# EAGLE design Fantail Go (EAGLE 9.2.2)

## Sheet 1 of 2
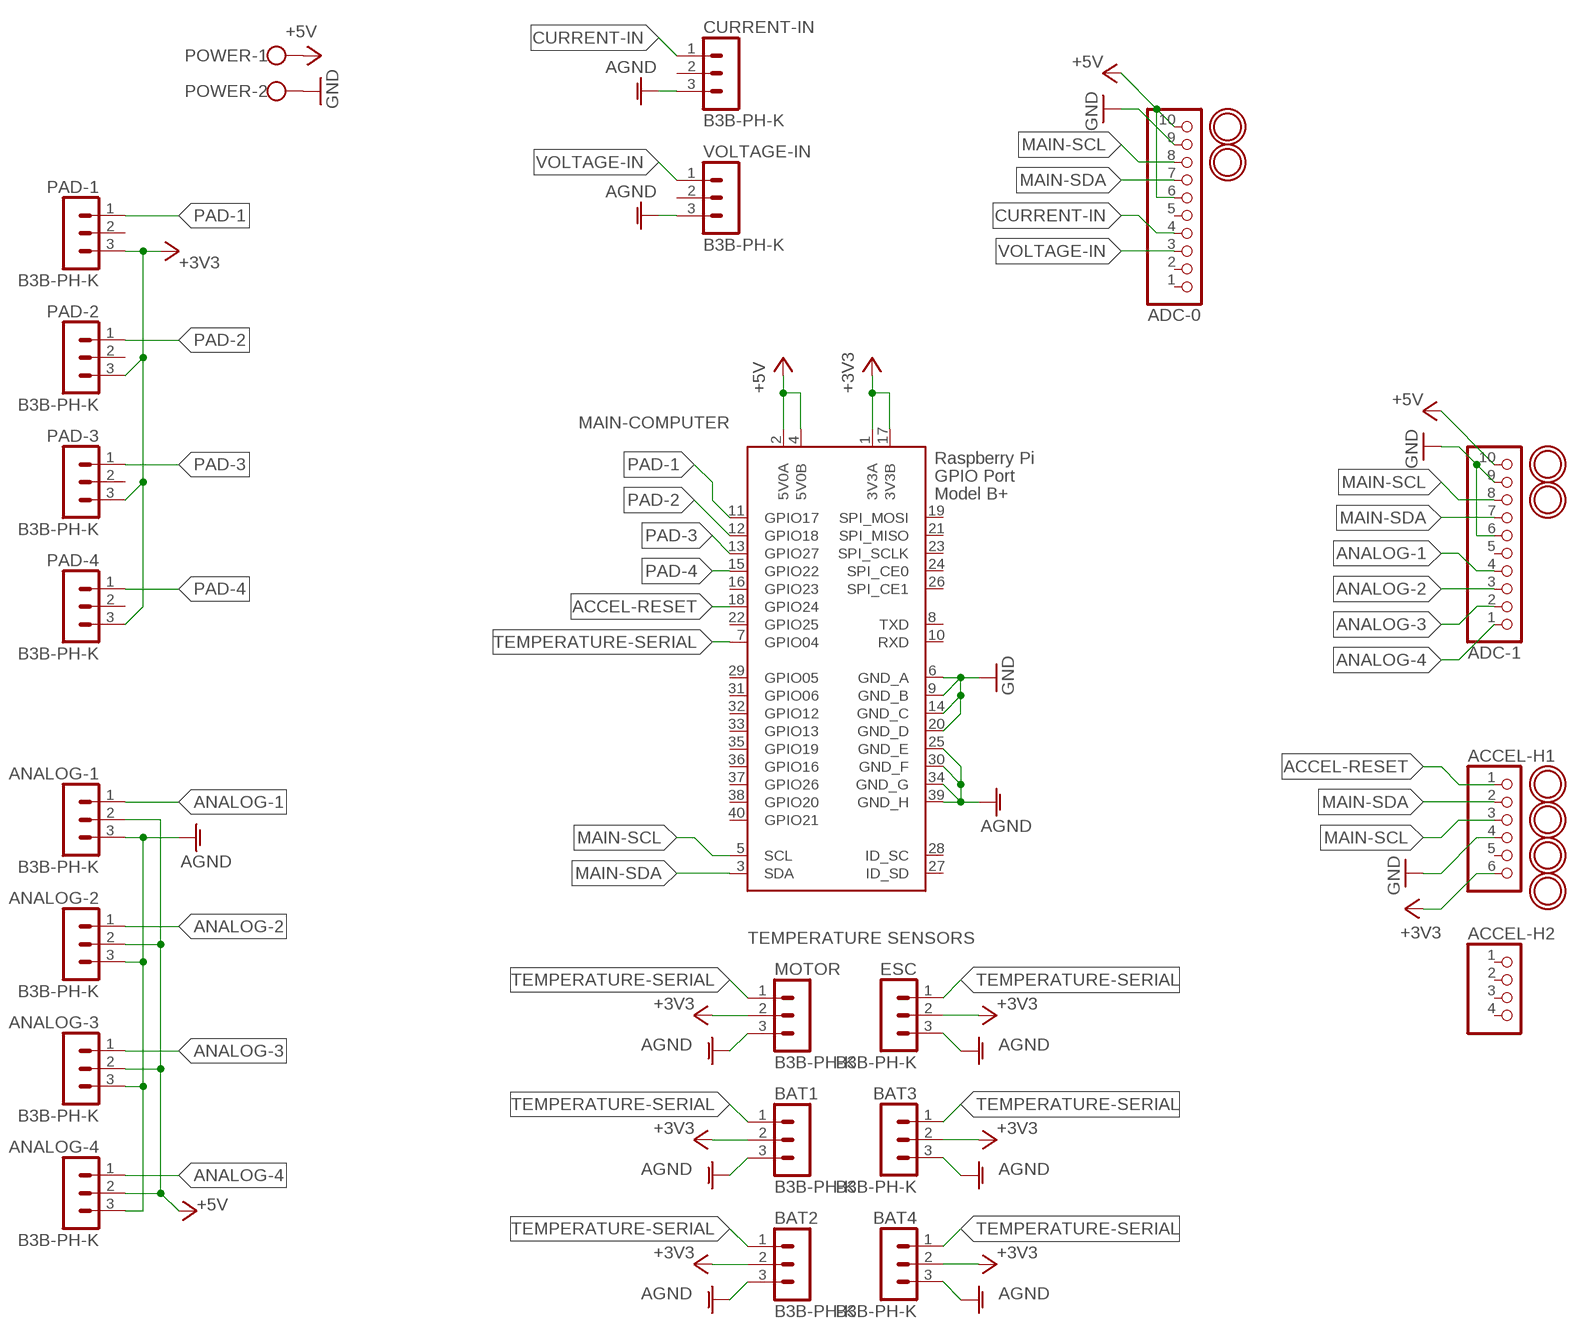
[diagram p0: schematic, sheet 1]

### Parts
ACCEL-H1  HEADER-1X670MIL  [1X06_ROUND_70]
ACCEL-H2  HEADER-1X4ROUND  [1X04_ROUND]
ADC-0  HEADER-1X1070MIL  [1X10_ROUND70]
ADC-1  HEADER-1X1070MIL  [1X10_ROUND70]
ANALOG-1  B3B-PH-K  [B3B-PH-K]
ANALOG-2  B3B-PH-K  [B3B-PH-K]
ANALOG-3  B3B-PH-K  [B3B-PH-K]
ANALOG-4  B3B-PH-K  [B3B-PH-K]
BAT1  B3B-PH-K  [B3B-PH-K]
BAT2  B3B-PH-K  [B3B-PH-K]
BAT3  B3B-PH-K  [B3B-PH-K]
BAT4  B3B-PH-K  [B3B-PH-K]
CURRENT-IN  B3B-PH-K  [B3B-PH-K]
ESC  B3B-PH-K  [B3B-PH-K]
MOTOR  B3B-PH-K  [B3B-PH-K]
PAD-1  B3B-PH-K  [B3B-PH-K]
PAD-2  B3B-PH-K  [B3B-PH-K]
PAD-3  B3B-PH-K  [B3B-PH-K]
PAD-4  B3B-PH-K  [B3B-PH-K]
POWER  W237-102  [W237-102]
U$5  MOUNTINGHOLE2.5  [MOUNTINGHOLE_2.5_PLATED]
U$15  MOUNTINGHOLE2.5  [MOUNTINGHOLE_2.5_PLATED]
U$16  MOUNTINGHOLE2.5  [MOUNTINGHOLE_2.5_PLATED]
U$18  MOUNTINGHOLE2.5  [MOUNTINGHOLE_2.5_PLATED]
U$19  MOUNTINGHOLE2.5  [MOUNTINGHOLE_2.5_PLATED]
U$20  MOUNTINGHOLE2.5  [MOUNTINGHOLE_2.5_PLATED]
U$21  MOUNTINGHOLE2.5  [MOUNTINGHOLE_2.5_PLATED]
U$22  MOUNTINGHOLE2.5  [MOUNTINGHOLE_2.5_PLATED]
VOLTAGE-IN  B3B-PH-K  [B3B-PH-K]
X1  RASPI_BOARD_B+#_F  [RASPI_BOARD_B+_FULL]

### Nets
+3V3: ACCEL-H1.6 BAT1.2 BAT2.2 BAT3.2 BAT4.2 ESC.2 MOTOR.2 PAD-1.3 PAD-2.3 PAD-3.3 PAD-4.3 X1.1(3V3A) X1.17(3V3B)
+5V: ADC-0.6 ADC-0.10 ADC-1.10 ANALOG-1.2 ANALOG-2.2 ANALOG-3.2 ANALOG-4.2 POWER.1 X1.2(5V0A) X1.4(5V0B) ; also sheet 2
ACCEL-RESET: ACCEL-H1.1 X1.18(GPIO24)
AGND: ANALOG-1.3 ANALOG-2.3 ANALOG-3.3 ANALOG-4.3 BAT1.3 BAT2.3 BAT3.3 BAT4.3 CURRENT-IN.3 ESC.3 MOTOR.3 VOLTAGE-IN.3 X1.25(GND_E) X1.30(GND_F) X1.34(GND_G) X1.39(GND_H)
ANALOG-1: ADC-1.4 ANALOG-1.1
ANALOG-2: ADC-1.3 ANALOG-2.1
ANALOG-3: ADC-1.2 ANALOG-3.1
ANALOG-4: ADC-1.1 ANALOG-4.1
CURRENT-IN: ADC-0.4 CURRENT-IN.1
GND: ACCEL-H1.4 ADC-0.9 ADC-1.6 ADC-1.9 POWER.2 X1.6(GND_A) X1.9(GND_B) X1.14(GND_C) X1.20(GND_D) ; also sheet 2
MAIN-SCL: ACCEL-H1.3 ADC-0.8 ADC-1.8 X1.5(SCL)
MAIN-SDA: ACCEL-H1.2 ADC-0.7 ADC-1.7 X1.3(SDA)
PAD-1: PAD-1.1 X1.11(GPIO17)
PAD-2: PAD-2.1 X1.12(GPIO18)
PAD-3: PAD-3.1 X1.13(GPIO27)
PAD-4: PAD-4.1 X1.15(GPIO22)
TEMPERATURE-SERIAL: BAT1.1 BAT2.1 BAT3.1 BAT4.1 ESC.1 MOTOR.1 X1.7(GPIO04)
VOLTAGE-IN: ADC-0.3 VOLTAGE-IN.1
Unconnected: ACCEL-H1.5 ACCEL-H2.1 ACCEL-H2.2 ACCEL-H2.3 ACCEL-H2.4 ADC-0.1 ADC-0.2 ADC-0.5 ADC-1.5 CURRENT-IN.2 PAD-1.2 PAD-2.2 PAD-3.2 PAD-4.2 VOLTAGE-IN.2 X1.8(TXD) X1.10(RXD) X1.16(GPIO23) X1.19(SPI_MOSI) X1.21(SPI_MISO) X1.22(GPIO25) X1.23(SPI_SCLK) X1.24(SPI_CE0) X1.26(SPI_CE1) X1.27(ID_SD) X1.28(ID_SC) X1.29(GPIO05) X1.31(GPIO06) X1.32(GPIO12) X1.33(GPIO13) X1.35(GPIO19) X1.36(GPIO16) X1.37(GPIO26) X1.38(GPIO20) X1.40(GPIO21)

### Notes on the sheet
- MAIN-COMPUTER
- TEMPERATURE SENSORS

## Sheet 2 of 2
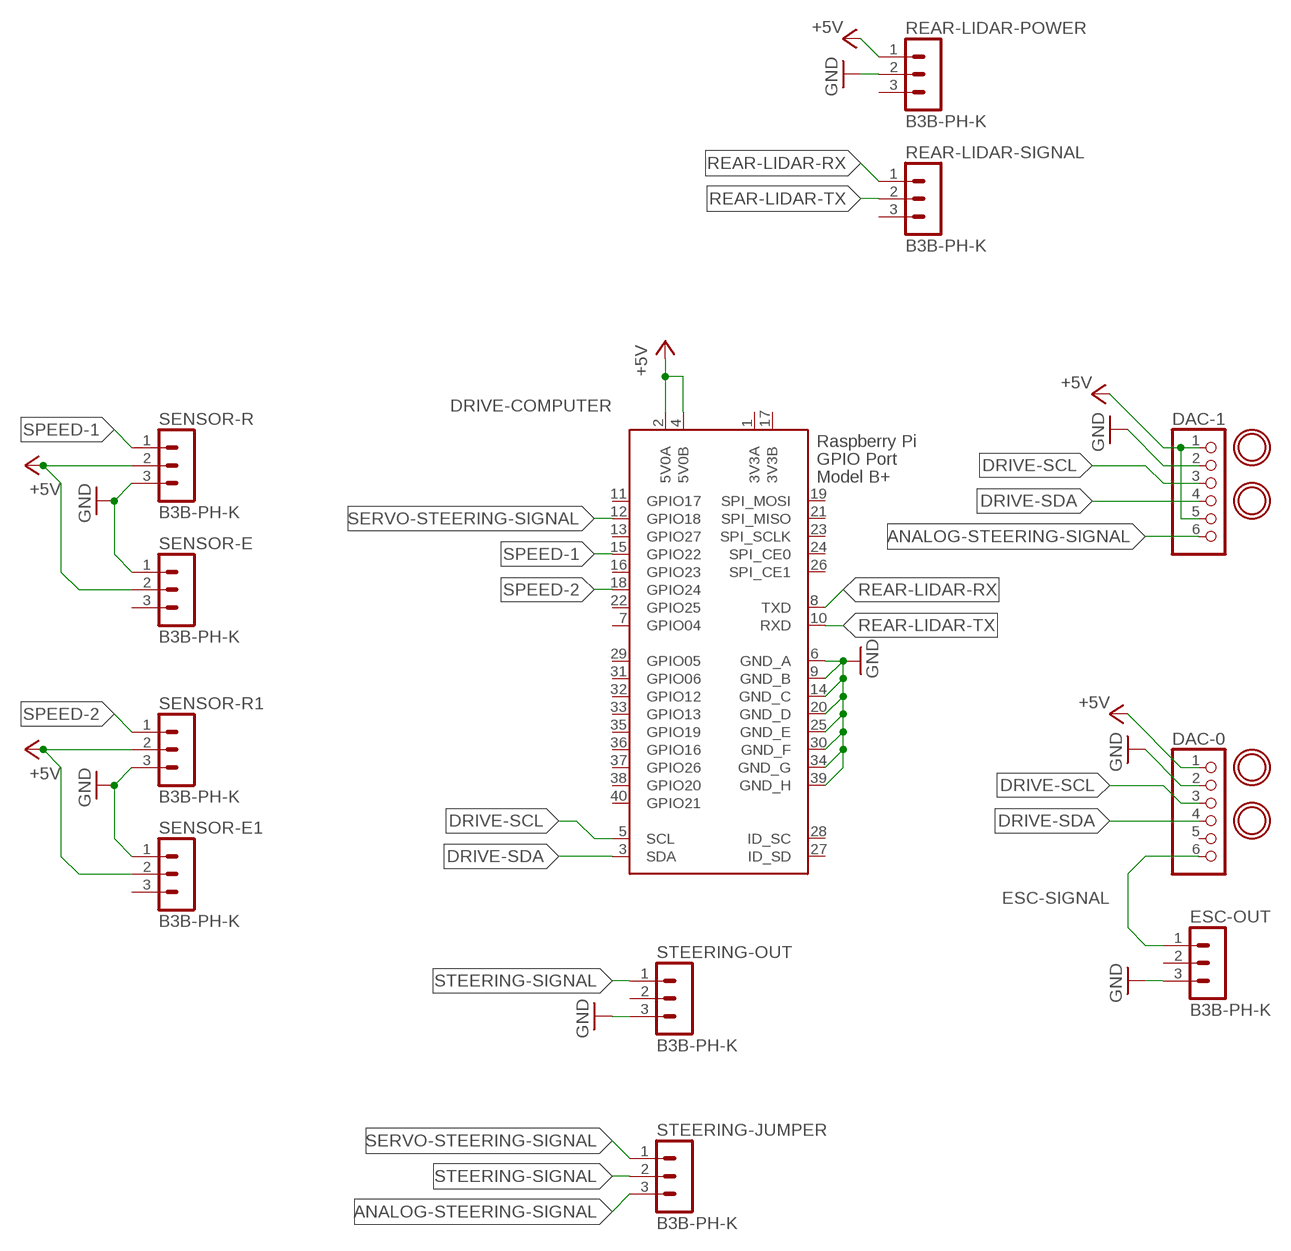
[diagram p1: schematic, sheet 2]

### Parts
DAC-0  HEADER-1X670MIL  [1X06_ROUND_70]
DAC-1  HEADER-1X670MIL  [1X06_ROUND_70]
ESC-OUT  B3B-PH-K  [B3B-PH-K]
REAR-LIDAR-POWER  B3B-PH-K  [B3B-PH-K]
REAR-LIDAR-SIGNAL  B3B-PH-K  [B3B-PH-K]
SENSOR-E  B3B-PH-K  [B3B-PH-K]
SENSOR-E1  B3B-PH-K  [B3B-PH-K]
SENSOR-R  B3B-PH-K  [B3B-PH-K]
SENSOR-R1  B3B-PH-K  [B3B-PH-K]
STEERING-JUMPER  B3B-PH-K  [B3B-PH-K]
STEERING-OUT  B3B-PH-K  [B3B-PH-K]
U$7  MOUNTINGHOLE2.5  [MOUNTINGHOLE_2.5_PLATED]
U$8  MOUNTINGHOLE2.5  [MOUNTINGHOLE_2.5_PLATED]
U$11  MOUNTINGHOLE2.5  [MOUNTINGHOLE_2.5_PLATED]
U$12  MOUNTINGHOLE2.5  [MOUNTINGHOLE_2.5_PLATED]
X2  RASPI_BOARD_B+#_F  [RASPI_BOARD_B+_FULL]

### Nets
+5V: DAC-0.1 DAC-1.1 DAC-1.5 REAR-LIDAR-POWER.1 SENSOR-E1.2 SENSOR-E.2 SENSOR-R1.2 SENSOR-R.2 X2.2(5V0A) X2.4(5V0B) ; also sheet 1
ANALOG-STEERING-SIGNAL: DAC-1.6 STEERING-JUMPER.3
DRIVE-SCL: DAC-0.3 DAC-1.3 X2.5(SCL)
DRIVE-SDA: DAC-0.4 DAC-1.4 X2.3(SDA)
ESC-SIGNAL: DAC-0.6 ESC-OUT.1
GND: DAC-0.2 DAC-1.2 ESC-OUT.3 REAR-LIDAR-POWER.2 SENSOR-E1.1 SENSOR-E.1 SENSOR-R1.3 SENSOR-R.3 STEERING-OUT.3 X2.6(GND_A) X2.9(GND_B) X2.14(GND_C) X2.20(GND_D) X2.25(GND_E) X2.30(GND_F) X2.34(GND_G) X2.39(GND_H) ; also sheet 1
REAR-LIDAR-RX: REAR-LIDAR-SIGNAL.1 X2.8(TXD)
REAR-LIDAR-TX: REAR-LIDAR-SIGNAL.2 X2.10(RXD)
SERVO-STEERING-SIGNAL: STEERING-JUMPER.1 X2.12(GPIO18)
SPEED-1: SENSOR-R.1 X2.15(GPIO22)
SPEED-2: SENSOR-R1.1 X2.18(GPIO24)
STEERING-SIGNAL: STEERING-JUMPER.2 STEERING-OUT.1
Unconnected: DAC-0.5 ESC-OUT.2 REAR-LIDAR-POWER.3 REAR-LIDAR-SIGNAL.3 SENSOR-E1.3 SENSOR-E.3 STEERING-OUT.2 X2.7(GPIO04) X2.11(GPIO17) X2.13(GPIO27) X2.16(GPIO23) X2.19(SPI_MOSI) X2.21(SPI_MISO) X2.22(GPIO25) X2.23(SPI_SCLK) X2.24(SPI_CE0) X2.26(SPI_CE1) X2.27(ID_SD) X2.28(ID_SC) X2.29(GPIO05) X2.31(GPIO06) X2.32(GPIO12) X2.33(GPIO13) X2.35(GPIO19) X2.36(GPIO16) X2.37(GPIO26) X2.38(GPIO20) X2.40(GPIO21)

### Notes on the sheet
- DRIVE-COMPUTER

## Power pins joined to a net without a drawn wire
3V3A: X2.1(3V3A)
3V3B: X2.17(3V3B)

## Library data of the parts
ACCEL-H1 DAC-0 DAC-1 = microbuilder:HEADER-1X6: PIN HEADER
ACCEL-H2 = microbuilder:HEADER-1X4: PIN HEADER
ADC-0 ADC-1 = microbuilder:HEADER-1X10: PIN HEADER
ANALOG-1-ANALOG-4 BAT1-BAT4 CURRENT-IN ESC ESC-OUT MOTOR PAD-1-PAD-4 REAR-LIDAR-POWER REAR-LIDAR-SIGNAL SENSOR-E SENSOR-E1 SENSOR-R SENSOR-R1 STEERING-JUMPER STEERING-OUT VOLTAGE-IN = con-jst-ph:B3B-PH-K: HEADER
POWER = con-wago-500:W237-102: WAGO SCREW CLAMP; MPN: 237-102; OC_FARNELL: unknown; OC_NEWARK: 70K9898
U$5 U$7 U$8 U$11 U$12 U$15 U$16 U$18-U$22 = microbuilder:MOUNTINGHOLE: Mounting Hole For #2 screws (0.086"/2.18mm width, 0.094"/2.4mm hole) use 2.5mm
X1 X2 = raspberrypi_bastelstube_v13:RASPI_BOARD_B+#: Raspberry Pi GPIO connector with markings for the outer dimensions of the Raspberry Pi board model B+ with different sets of drill holes or mounting pads All pins connected

## Board
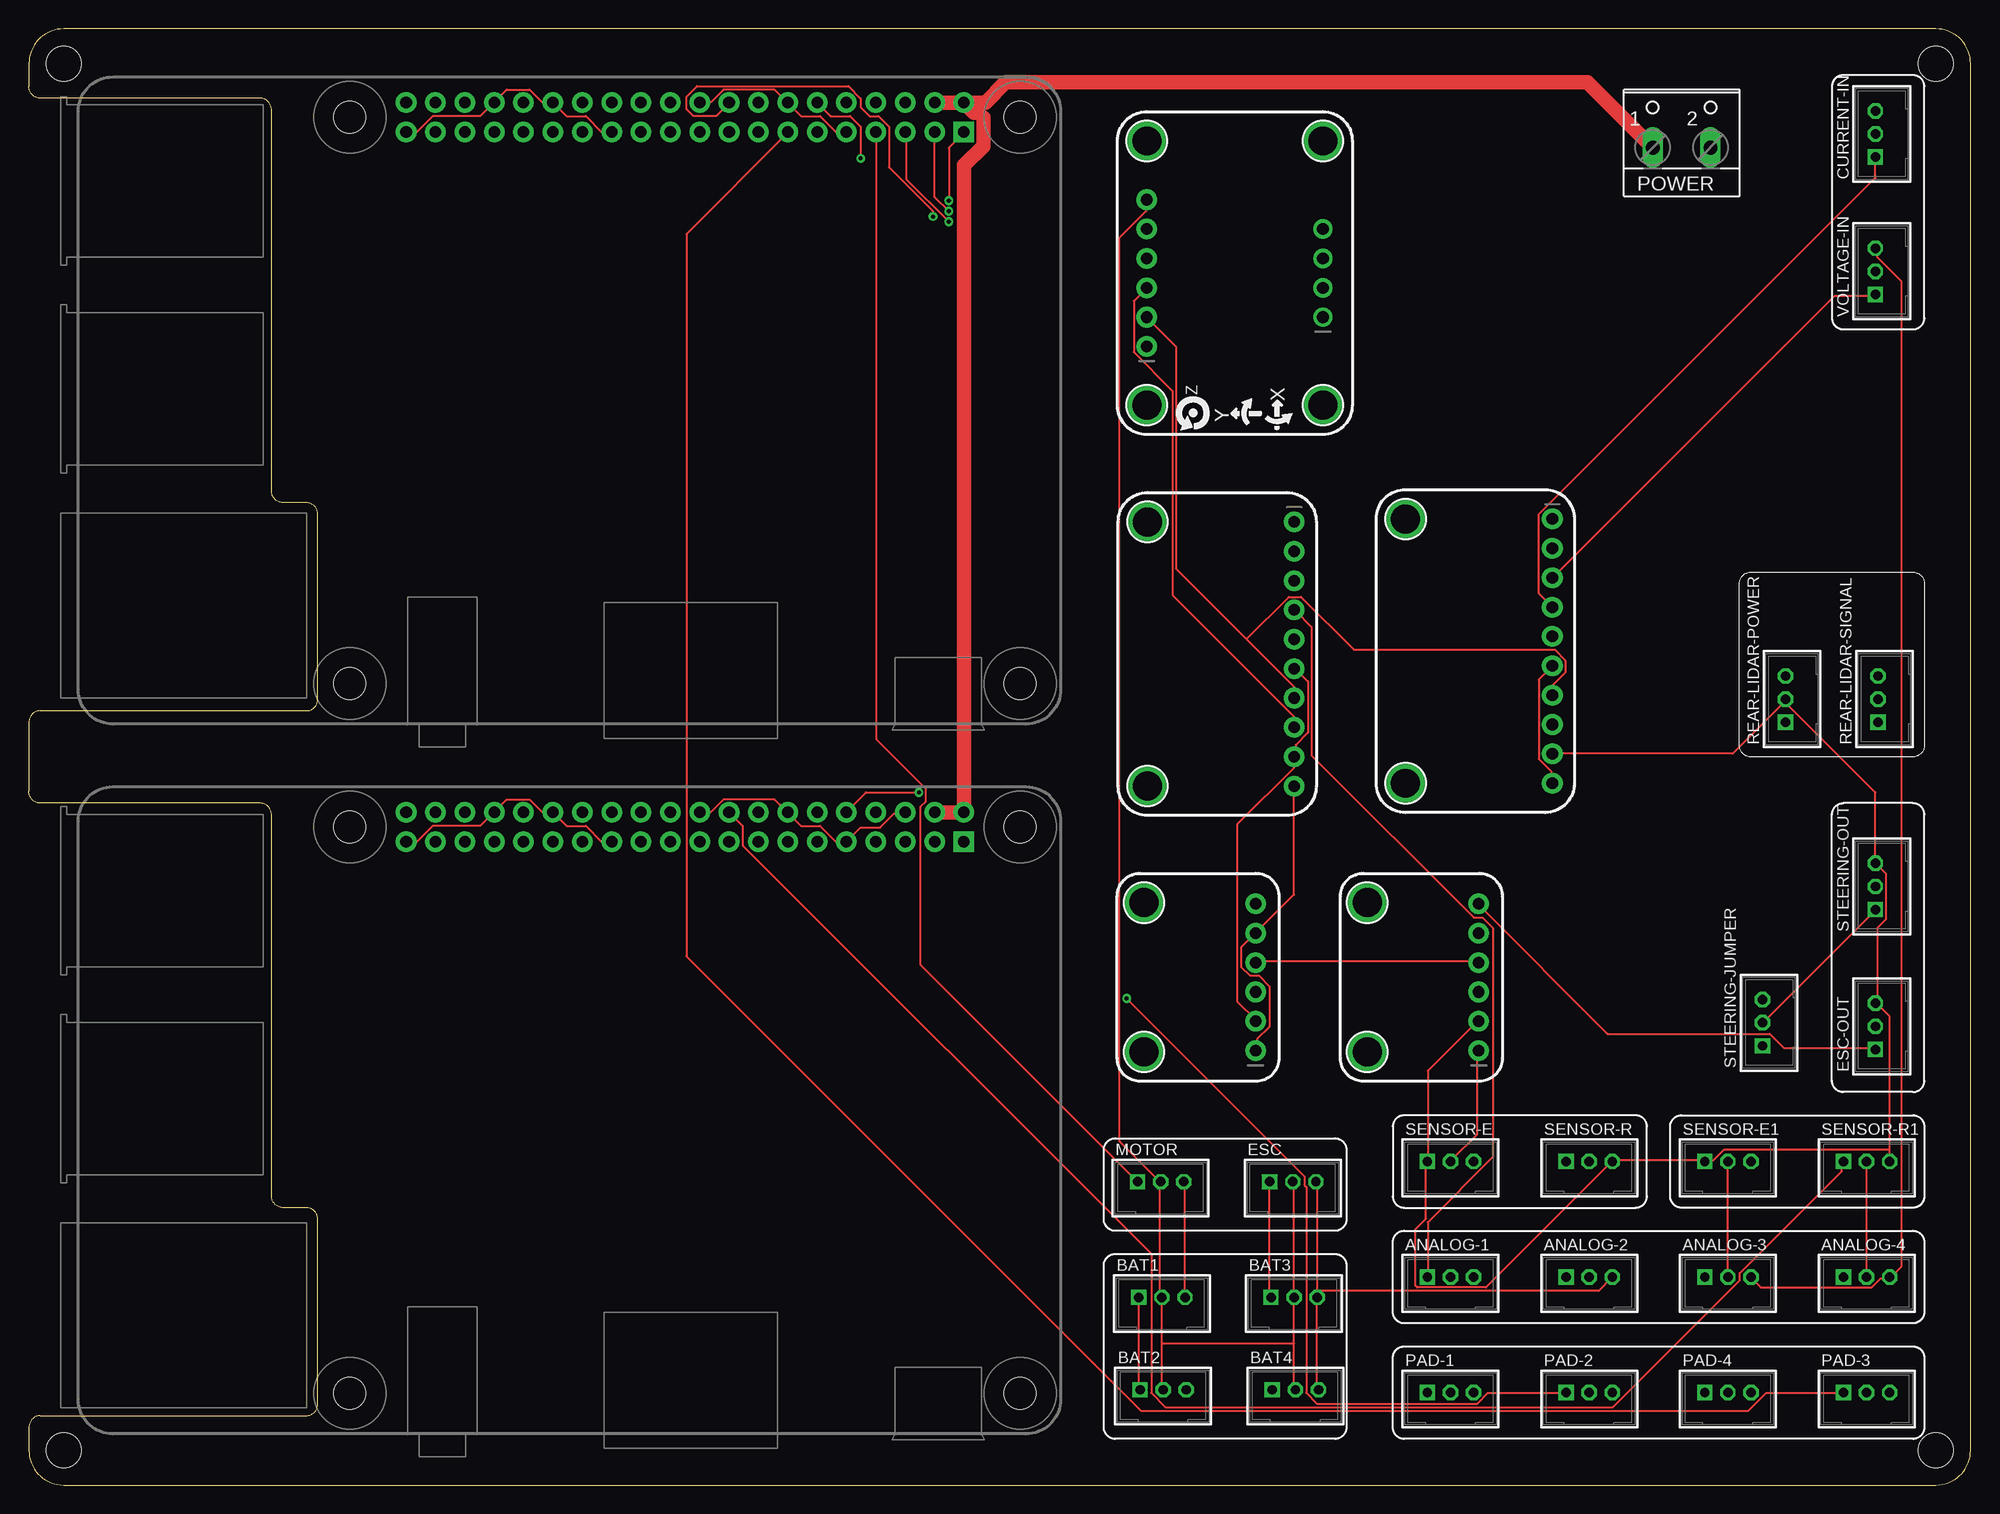
[diagram p2: board, top side]
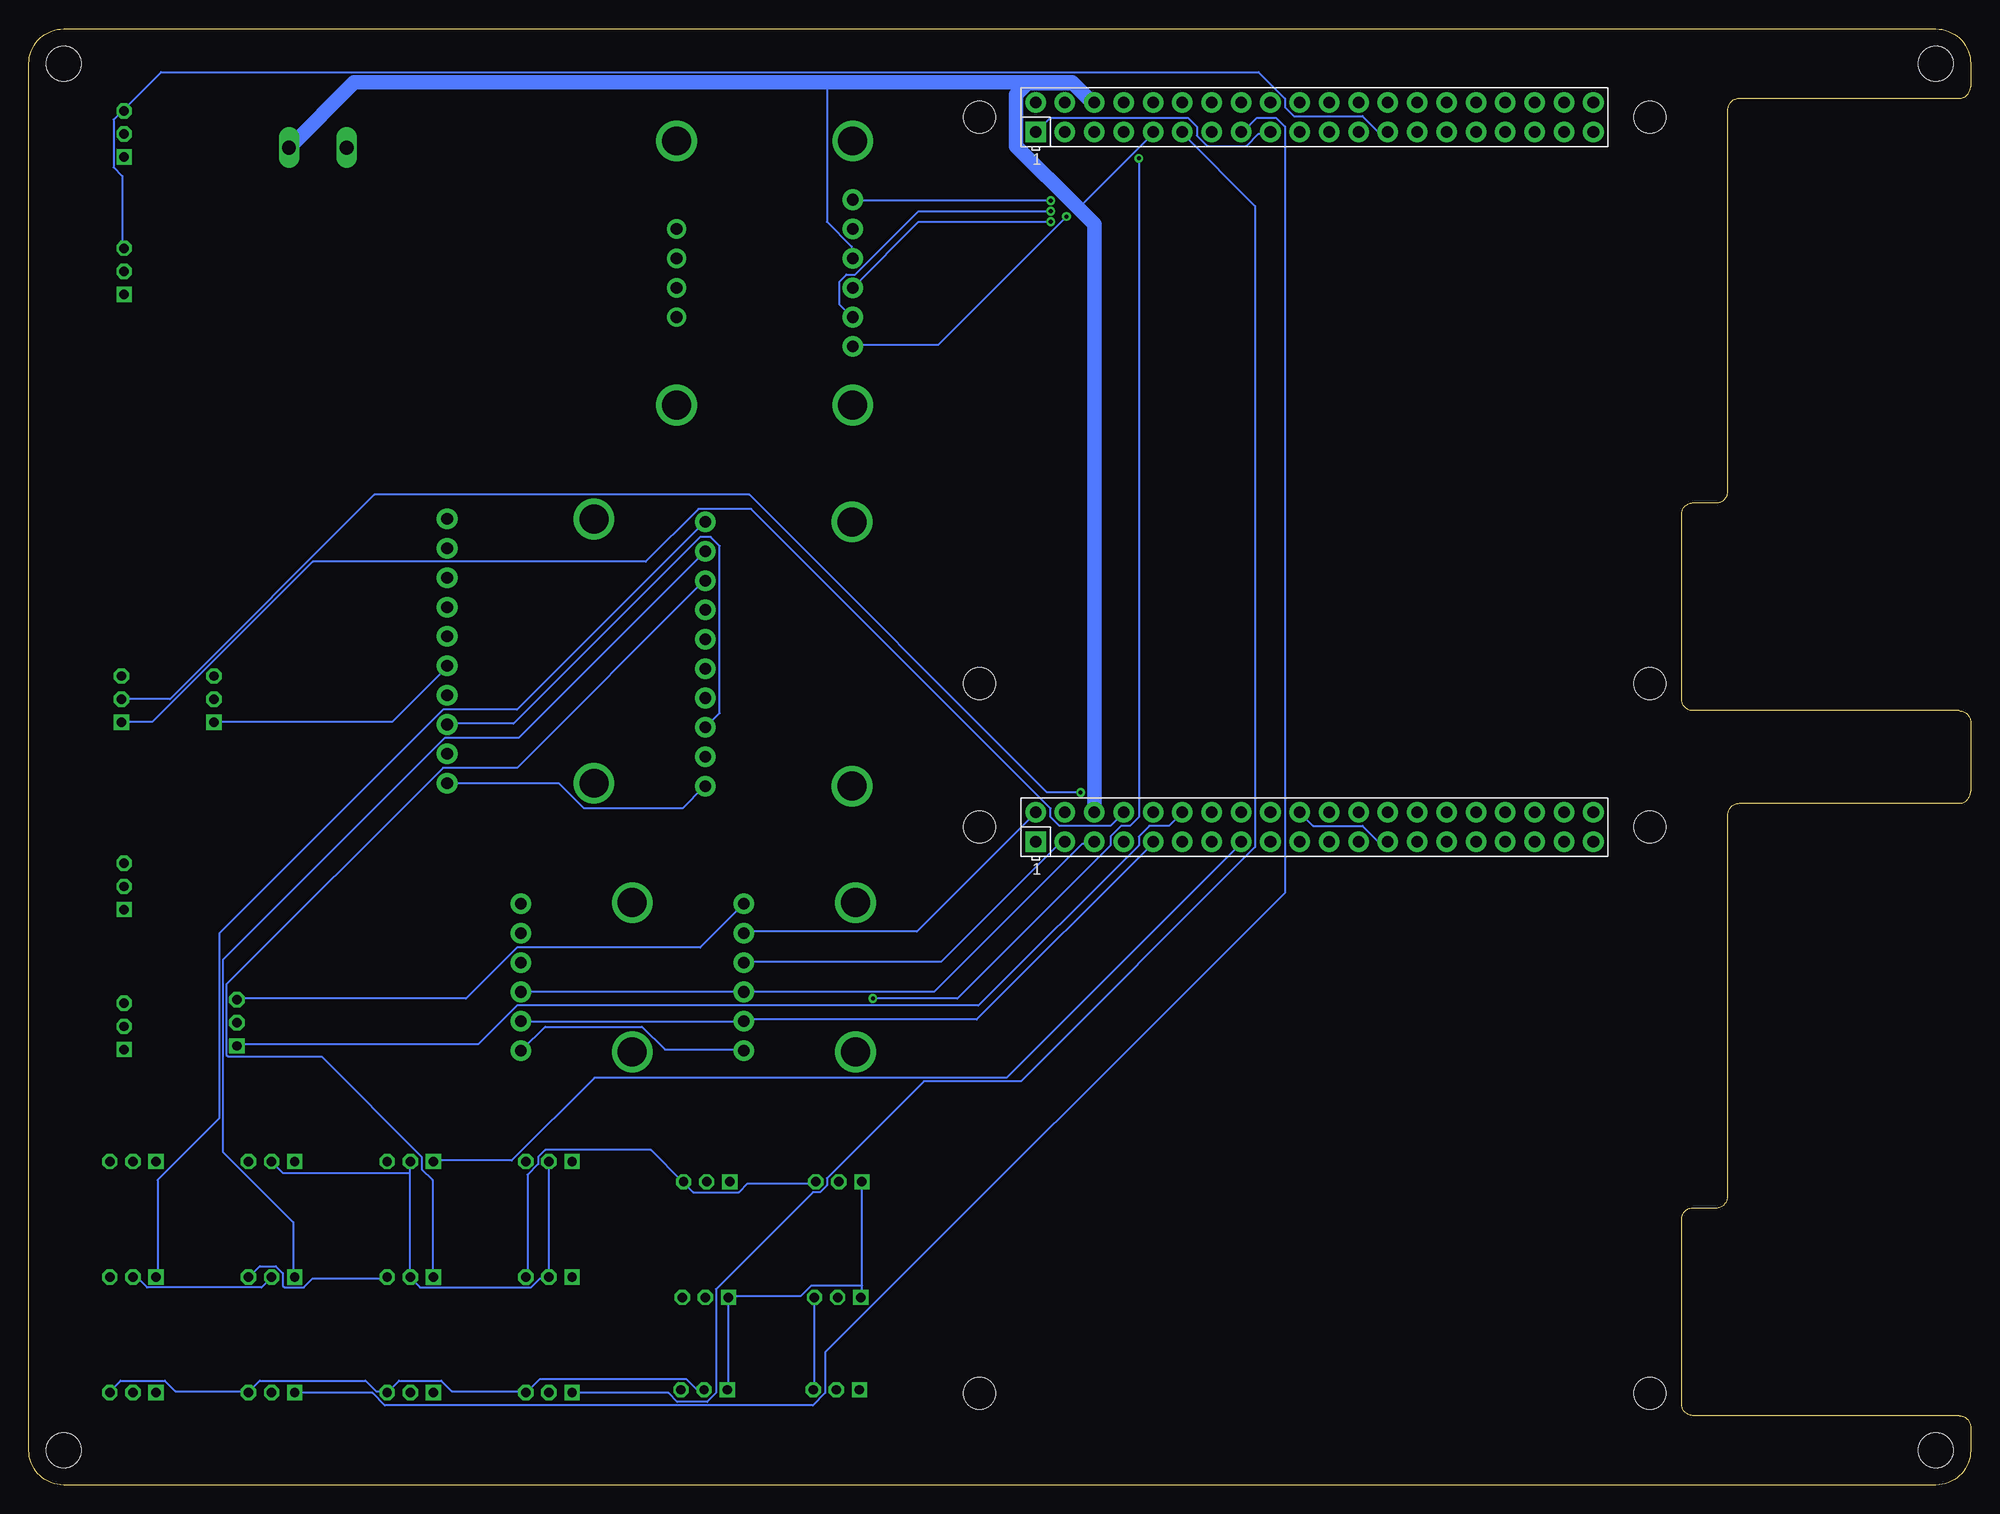
[diagram p3: board, bottom side, seen from below]

Size 168 x 126 mm. Coordinates in mm from the lower left corner, seen from the top.
Outline: 1,6 24,6 arc90 25,7 25,23 arc90 24,24 22,24 arc-90 21,25 21,58 arc90 20,59 1,59 arc-90 0,60 0,66 arc-90 1,67 24,67 arc90 25,68 25,84 arc90 24,85 22,85 arc-90 21,86 21,119 arc90 20,120 1,120 arc-90 0,121 0,123 arc-90 3,126 165,126 arc-90 168,123 168,3 arc-90 165,0 3,0 arc-90 0,3 0,5 arc-90 1,6
Copper layers (1*16): Top 0.035mm / dielectric 1.5mm / Bottom 0.035mm
Design rules "default": minimum track width 6mil, minimum drill 0.35mm, track to track 6mil, track to pad 6mil, pad to pad 6mil, via to via 6mil, smd to smd 6mil, copper to edge 40mil, drill to drill 6mil, minimum pad ring 10mil, minimum via ring 8mil, stop-mask expansion 4mil, vias tented up to drill 0mil, thermal gap 10mil
Holes 3 mm at 3,3 165,3 165,123 3,123

### Footprints (pad centres in the part's own frame; a part is rotated, then mirrored left to right if it is on the bottom)
1X06_ROUND_70 = drill 1 pad 1.778: 1 -6.35,0; 2 -3.81,0; 3 -1.27,0; 4 1.27,0; 5 3.81,0; 6 6.35,0
1X04_ROUND = drill 1 pad 1.676: 1 -3.81,0; 2 -1.27,0; 3 1.27,0; 4 3.81,0
1X10_ROUND70 = drill 1 pad 1.778: 1 -11.43,0; 2 -8.89,0; 3 -6.35,0; 4 -3.81,0; 5 -1.27,0; 6 1.27,0; 7 3.81,0; 8 6.35,0; 9 8.89,0; 10 11.43,0
B3B-PH-K = drill 0.813 square: 1 -2,0 | drill 0.813 octagon: 2 0,0; 3 2,0
W237-102 = drill 1.194 long: 1 -2.5,-1.27; 2 2.5,-1.27
MOUNTINGHOLE_2.5_PLATED = drill 2.5 pad 3.2: P$1 0,0
RASPI_BOARD_B+_FULL = drill 1 pad 1.778 square: 1 8.37,51.23 | drill 1 pad 1.778: 2 8.37,53.77; 3 10.91,51.23; 4 10.91,53.77; 5 13.45,51.23; 6 13.45,53.77; 7 15.99,51.23; 8 15.99,53.77; 9 18.53,51.23; 10 18.53,53.77; 11 21.07,51.23; 12 21.07,53.77; 13 23.61,51.23; 14 23.61,53.77; 15 26.15,51.23; 16 26.15,53.77; 17 28.69,51.23; 18 28.69,53.77; 19 31.23,51.23; 20 31.23,53.77; 21 33.77,51.23; 22 33.77,53.77; 23 36.31,51.23; 24 36.31,53.77; 25 38.85,51.23; 26 38.85,53.77; 27 41.39,51.23; 28 41.39,53.77; 29 43.93,51.23; 30 43.93,53.77; 31 46.47,51.23; 32 46.47,53.77; 33 49.01,51.23; 34 49.01,53.77; 35 51.55,51.23; 36 51.55,53.77; 37 54.09,51.23; 38 54.09,53.77; 39 56.63,51.23; 40 56.63,53.77 | hole 2.75: 3.5,3.5; 3.5,52.5; 61.5,3.5; 61.5,52.5

### Placement (x,y rotation side)
ACCEL-H1  96.72,104.87 90 top
ACCEL-H2  111.96,104.87 90 top
ADC-0  131.81,72.16 270 top
ADC-1  109.48,71.91 270 top
ANALOG-1  123,18 0 top
ANALOG-2  135,18 0 top
ANALOG-3  147,18 0 top
ANALOG-4  159,18 0 top
BAT1  98.03,16.24 0 top
BAT2  98.14,8.24 0 top
BAT3  109.47,16.24 0 top
BAT4  109.58,8.24 0 top
CURRENT-IN  159.76,116.91 90 top
DAC-0  125.45,43.94 90 top
DAC-1  106.13,43.94 90 top
ESC  109.36,26.24 0 top
ESC-OUT  159.76,39.69 90 top
MOTOR  97.92,26.24 0 top
PAD-1  123,8 0 top
PAD-2  135,8 0 top
PAD-3  159,8 0 top
PAD-4  147,8 0 top
POWER  143,117 0 top
REAR-LIDAR-POWER  152,68 90 top
REAR-LIDAR-SIGNAL  160,68 90 top
SENSOR-E  123,28 0 top
SENSOR-E1  147,28 0 top
SENSOR-R  135,28 0 top
SENSOR-R1  159,28 0 top
STEERING-JUMPER  150,40 90 top
STEERING-OUT  159.76,51.8 90 top
U$5  96.72,93.44 270 top
U$7  96.48,37.48 90 top
U$8  96.48,50.4 90 top
U$11  115.8,37.48 90 top
U$12  115.8,50.4 90 top
U$15  96.78,83.34 270 top
U$16  96.78,60.48 270 top
U$18  119.11,83.59 270 top
U$19  111.96,116.3 270 top
U$20  111.96,93.44 270 top
U$21  96.72,116.3 270 top
U$22  119.11,60.73 270 top
U$35  [SYMBOL_GYRO_CCLOCKWISE]  106.75,93.95 270 top
U$36  [SYMBOL_GYRO_CLOCKWISE]  107.01,94.33 180 top
U$37  [SYMBOL_GYRO_Z]  99.26,94.2 270 top
VOLTAGE-IN  159.76,105.02 90 top
X1  89.27,65.85 0 bottom
X2  89.27,4.43 0 bottom

### Tracks (layer width: path | path; a pad name or v marks a point on that pad's centre or on a via)
+3V3  (via drill 0.35)
  Top 0.152: v79.59,111.14 79.59,115.71 80.81,116.93 X1.1 | 98.03,12.23 98.03,8.27 BAT2.2 | 98.03,12.23 98.03,16.19 BAT1.2 97.88,16.34 97.88,26.1 MOTOR.2 97.88,26.25 94.37,29.76 94.37,107.94 96.66,110.22 96.66,111.14 ACCEL-H1.6 | 109.46,12.23 109.46,8.27 BAT4.2 | 109.46,12.23 109.46,16.19 BAT3.2 109.46,16.34 109.46,26.1 ESC.2 | 109.46,12.23 98.03,12.23
  Bottom 0.152: X1.17 60.69,116.93 61.61,116.93 62.67,115.86 66.03,115.86 66.94,116.78 66.94,117.54 67.7,118.3 79.59,118.3 80.81,117.08 X1.1 | v79.59,111.14 96.66,111.14 ACCEL-H1.6 | PAD-3.3 160.97,8.12 160.06,9.03 156.25,9.03 155.33,8.12 149.09,8.12 PAD-4.3 148.93,8.12 148.02,9.03 138.87,9.03 137.96,8.12 137.04,8.12 PAD-2.3 136.89,8.12 135.98,9.03 132.32,9.03 131.41,8.12 125.01,8.12 PAD-1.3 124.85,8.12 123.79,9.18 111.14,9.18 110.22,8.27 109.61,8.27 BAT4.2
+5V
  Top 0.152: ADC-0.10 131.71,60.84 131.71,61.76 130.64,62.83 130.64,69.68 131.71,70.75 ADC-0.6 | DAC-1.1 106.26,37.68 106.26,38.59 107.33,39.66 107.33,43.17 106.41,44.08 105.65,44.08 104.89,44.84 104.89,46.52 106.11,47.74 DAC-1.5 106.26,47.89 109.46,51.09 109.46,60.39 ADC-1.10 | DAC-0.1 125.31,37.53 125.31,30.36 123.02,28.08 SENSOR-E.2 | ANALOG-4.2 158.99,18.02 158.99,27.93 SENSOR-R1.2 | ANALOG-3.2 146.95,18.02 146.95,27.93 SENSOR-E1.2
  Top 1.27: X2.4 X2.2 80.9,114.19 82.58,115.86 82.58,118.3 82.11,118.76 81.76,118.76 X1.2 | X1.4 X1.2 | X1.2 82.76,119.62 84.52,121.38 134.85,121.38 POWER.1
  Bottom 0.152: REAR-LIDAR-POWER.1 151.98,66.03 136.59,66.03 131.86,70.75 ADC-0.6 | SENSOR-E.2 123.02,27.93 123.02,18.02 ANALOG-1.2 123.02,17.87 123.79,17.87 124.55,17.11 134.15,17.11 134.91,17.87 ANALOG-2.2 135.06,18.02 135.06,27.01 | 135.06,27.01 135.06,27.93 SENSOR-R.2 | 135.06,27.01 146.04,27.01 146.95,27.93 SENSOR-E1.2 | ANALOG-4.2 158.99,17.87 158.53,17.87 157.77,17.11 147.87,17.11 147.1,17.87 ANALOG-3.2 | DAC-1.1 106.26,37.68 112.97,37.68 114.95,39.66 123.33,39.66 125.31,37.68 DAC-0.1 | ADC-0.10 131.71,60.69 122.11,60.69 119.98,58.56 111.44,58.56 109.61,60.39 ADC-1.10 | DAC-1.5 106.11,47.89 91.17,47.89 80.96,58.1 X2.2
ACCEL-RESET  (via drill 0.35)
  Top 0.152: v78.22,109.77 78.22,110.22 74.41,114.03 74.41,117.54 73.49,118.45 72.73,118.45 71.97,119.21 71.97,119.98 70.9,121.04 57.8,121.04 56.88,120.13 56.88,119.06 57.49,118.45 59.47,118.45 60.54,119.52 X1.18
  Bottom 0.152: v78.22,109.77 89.34,98.64 96.66,98.64 ACCEL-H1.1
AGND
  Top 0.152: MOTOR.3 100.01,26.1 100.01,16.34 BAT1.3 | BAT3.3 111.44,16.19 111.44,8.27 BAT4.3 | 111.44,16.8 111.44,26.1 ESC.3 | 111.44,16.8 111.44,16.34 BAT3.3 | X1.39 33.57,117.08 34.94,118.45 39.05,118.45 40.12,119.52 X1.34 40.27,119.67 41.34,120.74 43.32,120.74 44.39,119.67 45.3,119.67 X1.30 45.45,119.52 46.52,118.45 48.2,118.45 49.57,117.08 50.33,117.08 X1.25 | ANALOG-3.3 149.09,17.87 149.85,17.11 159.45,17.11 160.21,17.87 160.97,17.87 ANALOG-4.3 161.12,18.02 162.04,18.94 162.04,104.13 159.91,106.26 159.91,106.87 VOLTAGE-IN.3 | 111.44,16.8 135.83,16.8 136.89,17.87 ANALOG-2.3 | 111.44,16.8 BAT3.3
  Bottom 0.152: BAT1.3 100.01,16.19 100.01,8.27 BAT2.3 | ANALOG-1.3 124.85,18.02 124.85,26.86 123.94,27.77 123.94,28.38 123.33,28.99 114.19,28.99 111.44,26.25 ESC.3 111.29,26.1 110.53,25.34 106.56,25.34 105.8,26.1 100.01,26.1 MOTOR.3 | VOLTAGE-IN.3 159.91,107.02 159.91,113.27 160.67,114.03 160.67,118.15 159.91,118.91 CURRENT-IN.3 159.75,119.06 156.55,122.26 61.61,122.26 59.32,119.98 59.32,119.21 58.56,118.45 52.62,118.45 51.24,117.08 50.48,117.08 X1.25 | ANALOG-2.3 137.04,17.87 143.45,17.87 144.21,17.11 145.88,17.11 146.04,17.26 146.04,18.33 146.65,18.94 148.02,18.94 148.93,18.02 ANALOG-3.3
ANALOG-1
  Top 0.152: ANALOG-1.1 121.04,18.02 121.04,22.75 126.68,28.38 126.68,48.2 125.77,49.11 125.01,49.11 110.98,63.13 110.98,74.26 109.61,75.63 ADC-1.4
ANALOG-2
  Bottom 0.152: ANALOG-2.1 133.08,18.02 133.08,26.4 134,27.32 134,28.38 142.68,37.07 150.76,37.07 150.91,37.22 150.91,43.32 132.17,62.06 125.77,62.06 109.61,78.22 ADC-1.3
ANALOG-3
  Bottom 0.152: ANALOG-3.1 145.12,18.02 145.12,22.75 151.22,28.84 151.22,45.45 132.02,64.66 125.61,64.66 109.61,80.66 ADC-1.2
ANALOG-4
  Bottom 0.152: ANALOG-4.1 156.86,18.02 156.86,26.4 151.52,31.74 151.52,47.74 132.17,67.09 125.77,67.09 109.61,83.25 ADC-1.1
ANALOG-STEERING-SIGNAL
  Bottom 0.152: STEERING-JUMPER.3 150,42.1 130.19,42.1 125.77,46.52 109.92,46.52 106.26,50.18 DAC-1.6
CURRENT-IN
  Top 0.152: CURRENT-IN.1 159.75,114.8 159.75,113.12 130.64,84.01 130.64,77.15 131.71,76.08 ADC-0.4
DRIVE-SCL
  Bottom 0.152: DAC-0.3 125.31,42.71 106.26,42.71 DAC-1.3 106.11,42.71 89.65,42.71 76.85,55.51 75.93,55.51 X2.5
DRIVE-SDA
  Top 0.152: DAC-1.4 106.26,45.3 125.31,45.3 DAC-0.4
  Bottom 0.152: X2.3 78.37,55.51 78.83,55.51 89.04,45.3 106.11,45.3 DAC-1.4
ESC-SIGNAL
  Top 0.152: ESC-OUT.1 159.75,37.83 151.83,37.83 150.61,39.05 136.59,39.05 125.46,50.18 DAC-0.6
GND
  Top 0.152: ADC-1.6 109.61,70.6 110.68,69.53 110.68,65.11 109.61,64.05 109.61,63.13 ADC-1.9 109.46,62.98 109.46,62.06 104.58,57.19 104.58,41.8 106.11,40.27 DAC-1.2 | DAC-0.2 125.31,40.12 121.04,35.85 121.04,28.08 SENSOR-E.1 120.89,27.93 120.89,23.05 119.98,22.14 119.98,17.26 120.13,17.11 126.07,17.11 136.89,27.93 SENSOR-R.3 137.04,28.08 144.97,28.08 SENSOR-E1.1 145.12,28.08 145.73,28.08 146.65,28.99 160.97,28.99 | 160.97,28.99 160.97,40.58 159.91,41.64 ESC-OUT.3 159.91,41.8 159.91,48.2 160.67,48.96 160.67,52.92 159.91,53.68 STEERING-OUT.3 159.75,53.84 159.75,59.93 152.13,67.55 152.13,67.86 REAR-LIDAR-POWER.2 151.98,67.86 147.41,63.28 131.86,63.28 ADC-0.9 | 160.97,28.99 160.97,28.08 SENSOR-R1.3 | X2.39 33.57,55.66 34.94,57.03 39.05,57.03 40.12,58.1 X2.34 40.27,58.25 41.34,59.32 43.32,59.32 44.39,58.25 45.3,58.25 X2.30 45.45,58.1 46.52,57.03 48.2,57.03 49.57,55.66 50.33,55.66 X2.25 | X1.20 58.1,119.67 59.02,119.67 60.08,120.74 64.5,120.74 65.57,119.67 X1.14 65.72,119.52 66.79,118.45 68.47,118.45 69.84,117.08 70.6,117.08 X1.9 | X2.20 58.1,58.25 59.02,58.25 60.08,59.32 64.5,59.32 65.57,58.25 X2.14 65.72,58.1 66.79,57.03 68.47,57.03 69.84,55.66 70.6,55.66 X2.9 70.75,55.66 71.97,56.88 73.65,56.88 74.87,58.1 75.78,58.1 X2.6
  Bottom 0.152: DAC-0.2 125.31,40.12 106.26,40.12 DAC-1.2 106.11,40.27 85.99,40.27 70.75,55.51 X2.9 | 98.94,121.38 98.94,109.31 96.81,107.17 96.81,106.26 ACCEL-H1.4 | 77.2,110.48 70.75,116.93 X1.9 | X2.25 50.48,55.66 51.24,55.66 52.62,57.03 56.88,57.03 57.95,58.1 X2.20
  Bottom 1.27: 77.67,121.3 77.75,121.38 98.94,121.38 139.85,121.38 POWER.2 | 77.67,121.3 81.59,121.3 82.58,120.31 82.58,115.86 77.2,110.48 75.82,109.11 X2.6 | X1.6 75.99,119.62 77.67,121.3
MAIN-SCL  (via drill 0.35)
  Top 0.152: v79.59,109.31 75.93,112.97 75.93,116.93 X1.5 | ADC-1.8 109.46,65.57 109.46,66.48 98.94,77 98.94,94.68 95.59,98.03 95.59,102.45 96.66,103.52 ACCEL-H1.3
  Bottom 0.152: v79.59,109.31 91.02,109.31 96.66,103.67 ACCEL-H1.3 | ADC-0.8 131.71,65.87 126.07,65.87 109.92,82.03 109,82.03 108.24,81.27 108.24,66.79 109.46,65.57 ADC-1.8
MAIN-SDA  (via drill 0.35)
  Top 0.152: v79.59,110.22 78.37,111.44 78.37,116.93 X1.3 | 105.35,73.19 99.25,79.29 99.25,98.49 96.81,100.93 ACCEL-H1.2 | 105.35,73.19 109.46,69.08 109.46,68.16 ADC-1.7 | 105.35,73.19 109,76.85 110.07,76.85 114.64,72.28 132.02,72.28 132.93,71.36 132.93,70.29 131.86,69.23 131.86,68.47 ADC-0.7
  Bottom 0.152: v79.59,110.22 91.02,110.22 96.51,104.74 97.27,104.74 97.88,104.13 97.88,102.15 96.81,101.08 ACCEL-H1.2
PAD-1
  Bottom 0.152: PAD-1.1 120.89,7.96 112.66,7.96 111.9,7.2 109.31,7.2 108.55,7.96 108.55,16.95 100.16,25.34 99.56,25.34 98.94,25.95 98.94,26.55 90.56,34.94 82.18,34.94 61.91,55.21 61.91,110.68 68.16,116.93 X1.11
PAD-2  (via drill 0.35)
  Top 0.152: v94.98,42.1 110.38,26.71 110.38,25.95 110.53,25.79 110.53,7.96 111.44,7.05 125.31,7.05 126.22,7.96 132.93,7.96 PAD-2.1 | v71.97,114.8 71.97,117.54 71.06,118.45 69.38,118.45 68.31,119.52 X1.12
  Bottom 0.152: v94.98,42.1 87.67,42.1 74.41,55.36 74.41,56.12 73.49,57.03 72.73,57.03 71.97,57.8 v71.97,114.8
PAD-3
  Top 0.152: PAD-3.1 156.86,7.96 150.3,7.96 148.78,6.44 96.2,6.44 56.88,45.76 56.88,108.24 65.57,116.93 X1.13
PAD-4
  Bottom 0.152: PAD-4.1 144.97,7.96 138.26,7.96 137.2,6.9 100.16,6.9 99.1,7.96 99.1,11.47 59.32,51.24 59.32,117.54 60.08,118.3 61.76,118.3 62.98,117.08 X1.15
REAR-LIDAR-RX
  Bottom 0.152: REAR-LIDAR-SIGNAL.1 159.91,66.03 157.31,66.03 143.45,79.89 114.64,79.89 110.07,84.47 105.5,84.47 79.59,58.56 79.59,57.8 78.83,57.03 74.41,57.03 73.34,58.1 X2.8
REAR-LIDAR-TX  (via drill 0.35)
  Top 0.152: v77,59.93 72.43,59.93 70.75,58.25 X2.10
  Bottom 0.152: v77,59.93 79.89,59.93 105.65,85.69 138.11,85.69 155.79,68.01 159.91,68.01 REAR-LIDAR-SIGNAL.2
SERVO-STEERING-SIGNAL
  Bottom 0.152: STEERING-JUMPER.1 150,38.14 129.12,38.14 125.77,41.49 85.84,41.49 71.97,55.36 71.97,56.12 71.06,57.03 69.38,57.03 68.31,58.1 X2.12
SPEED-1
  Bottom 0.152: SENSOR-R.1 132.93,28.08 126.22,28.08 119.06,35.24 83.4,35.24 63.13,55.51 X2.15
SPEED-2
  Top 0.152: SENSOR-R1.1 156.86,27.93 156.86,27.16 148.02,18.33 148.02,17.72 137.04,6.74 98.34,6.74 97.12,7.96 97.12,20 61.76,55.36 61.76,57.03 60.69,58.1 X2.18
STEERING-SIGNAL
  Top 0.152: STEERING-JUMPER.2 150.15,40.12 159.75,49.72 STEERING-OUT.1
TEMPERATURE-SERIAL
  Top 0.152: ESC.1 107.33,26.1 107.33,16.34 BAT3.1 | BAT1.1 96.05,16.19 96.05,8.27 BAT2.1 | X1.7 73.34,116.93 73.34,64.5 77.61,60.24 77.61,59.17 77.15,58.71 77.15,45 95.9,26.25 MOTOR.1
  Bottom 0.152: BAT4.1 107.48,8.27 107.48,16.19 BAT3.1 107.33,16.34 101.23,16.34 100.32,17.26 95.9,17.26 | 95.9,17.26 95.9,16.34 BAT1.1 | 95.9,17.26 95.9,26.1 MOTOR.1
VOLTAGE-IN
  Top 0.152: VOLTAGE-IN.1 159.75,102.91 156.25,102.91 131.86,78.52 ADC-0.3

### Text on the board
tPlace: Z | X | Y